# Altium schematic sheet voltagesource.SchDoc: 548 Voltage source
size A4; Organization: Altium Limited; Address1: L3, 12a Rodborough Rd; Address2: Frenchs Forest; Address3: NSW; Address4: Australia 2086
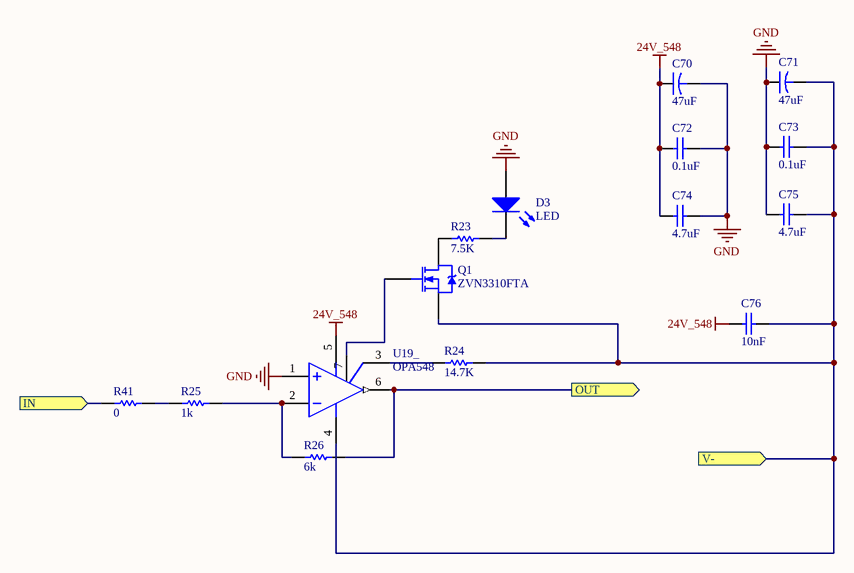
[diagram p0: voltagesource.SchDoc]

## Parts
C70  47uF  [bigcap]
C71  47uF  [bigcap]
C72  0.1uF  [0402_Cap]
C73  0.1uF  [0402_Cap]
C74  4.7uF  [0402_Cap]
C75  4.7uF  [0402_Cap]
C76  10nF  [0402_Cap]
D3  LED  [STD_LED]
Q1  ZVN3310FTA  [SOT-23B_M]
R23  7.5K  [0402_Res]
R24  14.7K  [0402_Res]
R25  1k  [0402_Res]
R26  6k  [0402_Res]
R41  0  [0402_Res]
U19_  OPA548  [TO-220-7]

## Ports
IN (in), OUT (out), V- (in)

## Nets
24V_548: C70.1 C72.1 C74.1 C76.1 U19_.5(V+)
GND: C70.2 C71.1 C72.2 C73.1 C74.2 C75.1 D3.1 U19_.1(IN-)
IN: R41.1 ; port IN
OUT: R26.2 U19_.6(OUT) ; port OUT
V-: C71.2 C73.2 C75.2 C76.2 Q1.3(S) R24.2 U19_.4(V-) ; port V-
NetD3_2: D3.2 R23.2
NetQ1_1: Q1.1(G) U19_.7(OS_NUL)
NetQ1_2: Q1.2(D) R23.1
NetR24_1: R24.1 U19_.3(TAB)
NetR25_1: R25.1 R41.2
NetR25_2: R25.2 R26.1 U19_.2(IN+)

## Notes on the sheet
- Title
- Date:
- RE:
- Arturo di Girolamo
- Size:
- A3
- A

## Library data of the parts
C70 C71 = UCY2C470MPD: Capacitor, 47uF NICHICON; MFGPN: UCY2C470MPD
C72 C73 = CL21B104KACNNNC: Capacitor, 0.1uF, 0805; Value: .01uf; ASYPN: GMK105BJ104KV-F; MFGPN: CL21B104KACNNNC
C74 C75 = CL21A475KAQNNNE: Capacitor, 4.7uF, 0805; Value: .01uf; ASYPN: C1005X5R1V105K050BC; MFGPN: CL21A475KAQNNNE
C76 = C0805C103K1RAC7210: Capacitor, 10nF, 0805; Value: .01uf; ASYPN: C1005X7S2A103K050BB; MFGPN: C0805C103K1RAC7210
D3 = LNJ037X8ARA: Typical LED; MFGPN: LNJ037X8ARA
Q1 = ZVN3310FTA: N-Channel Power MOSFET; ComponentLink1Description: Manufacturer Link; ComponentLink1URL: http://www.irf.com/; MFGPN: ZVN3310FTA
R23 = ERJ-PB6D7501V: 7.5K 1% 1/4W; Value: 1K; MFGPN: ERJ-PB6D7501V
R24 = RC0805FR-0714K7L: 14.7K 1% 1/4W; Value: 1K; ASYPN: ERJ-2RKF1472X; MFGPN: RC0805FR-0714K7L
R25 = RNCP0805FTD1K00: 1K 1% 1/4W; ASYPN: RMCF0402FT1K00; Value: 1K; MFGPN: RNCP0805FTD1K00
R26 = RMCF0805FT5K60: 6K 1% 1/4W; ASYPN: RMCF0402FT5K90; Value: 6k; MFGPN: RMCF0805FT5K60
R41 = RMCF0805ZT0R00: 0 ohm jumper; Value: 0; MFGPN: RMCF0805ZT0R00; ASYPN: RMCF0805ZT0R00
U19_ = OPA548T: High power op amp; MFGPN: OPA548T